# Altium schematic sheet LDO_DDS.SchDoc
size 420 x 297 mm; Address1: Address1; Address2: Address2; Address3: Address3; Address4: Address4; SheetNumber: 1; Scale: 1:1; Разраб.: Иванов; Обозначение документа: АБВГ.123456.001 Э3; Пров.: Петров; Утв.: Сидоров; Наименование организации: ОАО "Концерн "МПО-Гидроприбор"; Перв. применение: АБВГ.123456.000; Наименование изделия 1: Плата; Наименование изделия 2: Схема электрическая; Наименование изделия 3: принципиальная; Нач. отд.: Нач. отд.; Фамилия нач. отд.: Сидоров
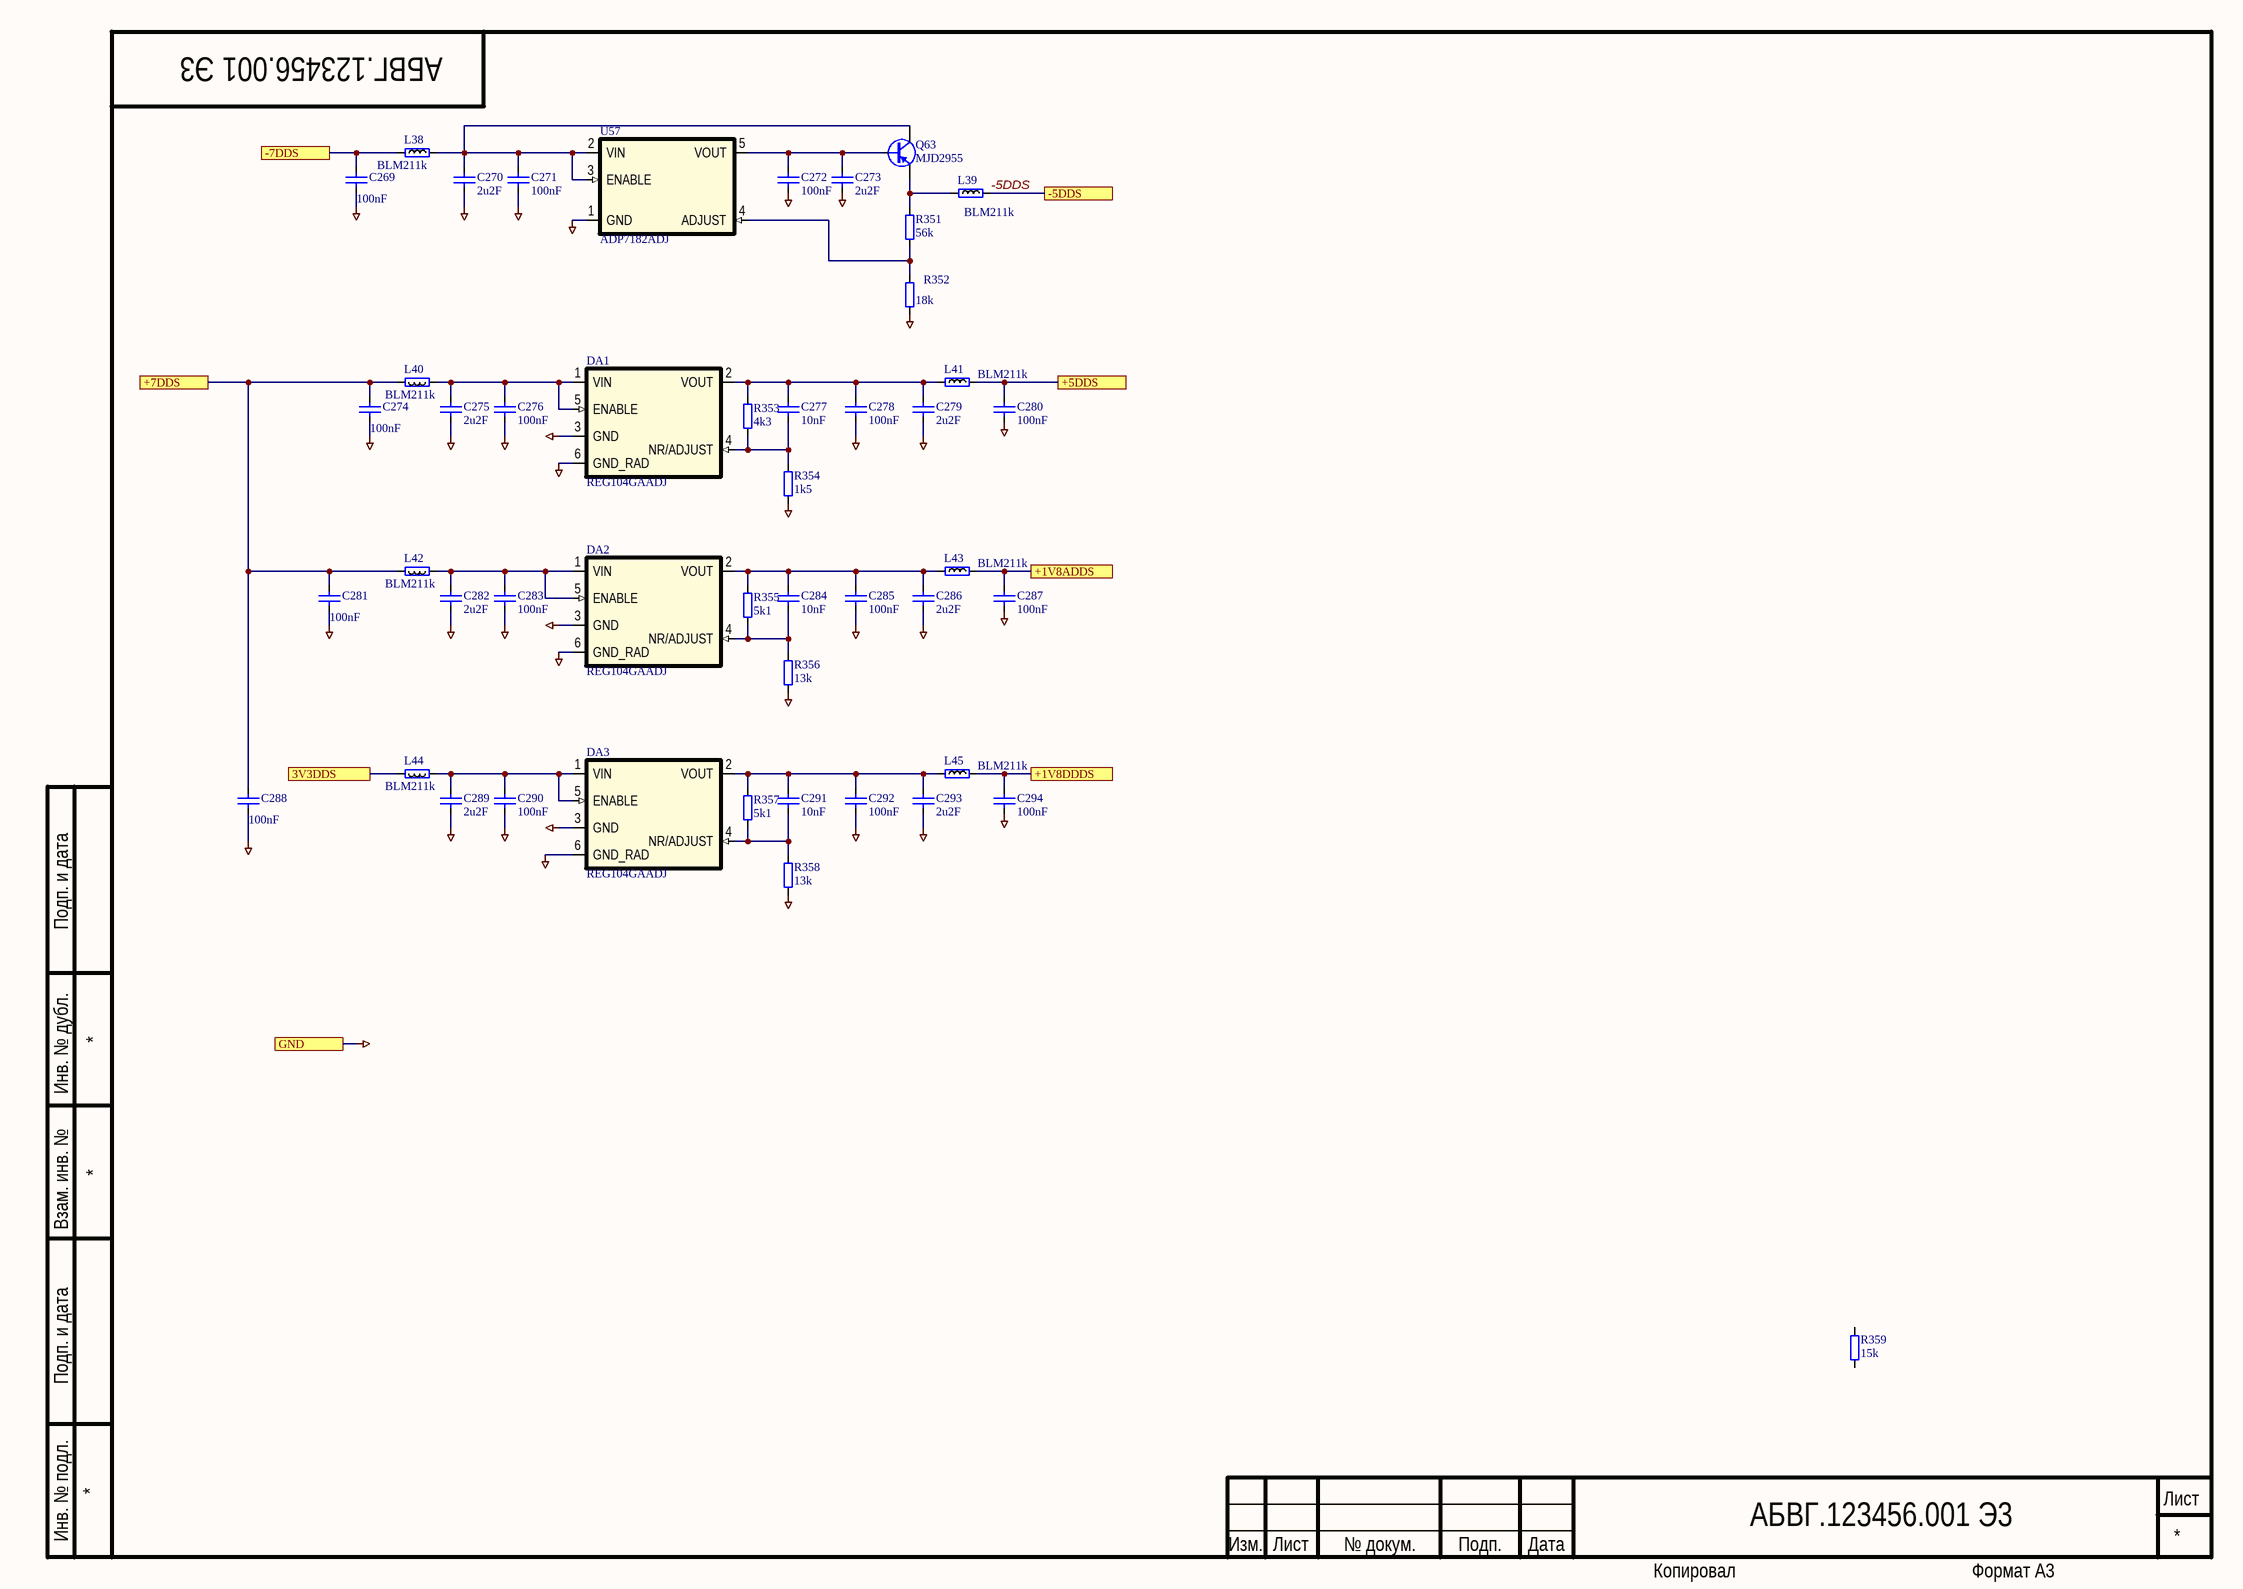
[diagram p0: LDO_DDS.SchDoc]

## Parts
C269  100nF  [SMD0805CAP]
C270  2u2F  [SMD0805CAP]
C271  100nF  [SMD0805CAP]
C272  100nF  [SMD0805CAP]
C273  2u2F  [SMD0805CAP]
C274  100nF  [SMD0805CAP]
C275  2u2F  [SMD0805CAP]
C276  100nF  [SMD0805CAP]
C277  10nF  [SMD0805CAP]
C278  100nF  [SMD0805CAP]
C279  2u2F  [SMD0805CAP]
C280  100nF  [SMD0805CAP]
C281  100nF  [SMD0805CAP]
C282  2u2F  [SMD0805CAP]
C283  100nF  [SMD0805CAP]
C284  10nF  [SMD0805CAP]
C285  100nF  [SMD0805CAP]
C286  2u2F  [SMD0805CAP]
C287  100nF  [SMD0805CAP]
C288  100nF  [SMD0805CAP]
C289  2u2F  [SMD0805CAP]
C290  100nF  [SMD0805CAP]
C291  10nF  [SMD0805CAP]
C292  100nF  [SMD0805CAP]
C293  2u2F  [SMD0805CAP]
C294  100nF  [SMD0805CAP]
DA1  REG104GAADJ  [SOT223_6-127]
DA2  REG104GAADJ  [SOT223_6-127]
DA3  REG104GAADJ  [SOT223_6-127]
L38  BLM211k  [RESC2012X50N]
L39  BLM211k  [RESC2012X50N]
L40  BLM211k  [RESC2012X50N]
L41  BLM211k  [RESC2012X50N]
L42  BLM211k  [RESC2012X50N]
L43  BLM211k  [RESC2012X50N]
L44  BLM211k  [RESC2012X50N]
L45  BLM211k  [RESC2012X50N]
Q63  MJD2955  [DPAK]
R351  56k  [SMD0805RES]
R352  18k  [SMD0805RES]
R353  4k3  [SMD0805RES]
R354  1k5  [SMD0805RES]
R355  5k1  [SMD0805RES]
R356  13k  [SMD0805RES]
R357  5k1  [SMD0805RES]
R358  13k  [SMD0805RES]
R359  15k  [SMD0805RES]
U57  ADP7182ADJ  [SOT23-5]

## Ports
3V3DDS, +1V8ADDS, +1V8DDDS, +5DDS, +7DDS, -5DDS, -7DDS, GND

## Nets
GND: C269.2 C270.2 C271.2 C272.1 C273.1 C274.2 C275.1 C276.1 C278.1 C279.1 C280.1 C281.2 C282.1 C283.1 C285.1 C286.1 C287.1 C288.2 C289.1 C290.1 C292.1 C293.1 C294.1 DA1.3(GND) DA1.6(GND_RAD) DA2.3(GND) DA2.6(GND_RAD) DA3.3(GND) DA3.6(GND_RAD) R352.1 R354.1 R356.1 R358.1 U57.1(GND) ; port GND
3V3DDS: L44.1 ; port 3V3DDS
+1V8ADDS: C287.2 L43.1 ; port +1V8ADDS
+1V8DDDS: C294.2 L45.1 ; port +1V8DDDS
+5DDS: C280.2 L41.1 ; port +5DDS
+7DDS: C274.1 C281.1 C288.1 L40.1 L42.1 ; port +7DDS
-5DDS: L39.1 ; port -5DDS
-7DDS: C269.1 L38.2 ; port -7DDS
NetC270_1: C270.1 C271.1 L38.1 Q63.3(C) U57.2(VIN) U57.3(ENABLE)
NetC272_2: C272.2 C273.2 Q63.1(B) U57.5(VOUT)
NetC275_2: C275.2 C276.2 DA1.1(VIN) DA1.5(ENABLE) L40.2
NetC277_1: C277.1 DA1.4(NR/ADJUST) R353.1 R354.2
NetC277_2: C277.2 C278.2 C279.2 DA1.2(VOUT) L41.2 R353.2
NetC282_2: C282.2 C283.2 DA2.1(VIN) DA2.5(ENABLE) L42.2
NetC284_1: C284.1 DA2.4(NR/ADJUST) R355.1 R356.2
NetC284_2: C284.2 C285.2 C286.2 DA2.2(VOUT) L43.2 R355.2
NetC289_2: C289.2 C290.2 DA3.1(VIN) DA3.5(ENABLE) L44.2
NetC291_1: C291.1 DA3.4(NR/ADJUST) R357.1 R358.2
NetC291_2: C291.2 C292.2 C293.2 DA3.2(VOUT) L45.2 R357.2
NetL39_2: L39.2 Q63.2(E) R351.2
NetR351_1: R351.1 R352.2 U57.4(ADJUST)

Not connected (* = marked no-connect by the designer): R359 1 2

## Notes on the sheet
- Подп. и дата
- Инв. № дубл.
- Взам. инв. №
- Инв. № подл.
- Изм.
- Лист
- № докум.
- Подп.
- Дата
- Копировал
- Формат А3

## Library data of the parts
C269-C294 = C0805: Чип конденсатор 0805; Voltage: 25V; Vendor: Vishay; DielectricType: X5R; SMD Solders: 2; Solder Option: RM; Tolerance: 20%; Pkg: SMD0805; Device: Cap0805; Price: 2
  C269 C271 C272 C274 C276 C278 C280 C281 C283 C285 C287 C288 C290 C292 C294: Value: 100nF
  C270 C273 C275 C279 C282 C286 C289 C293: Value: 2u2F
  C277 C284 C291: Value: 10nF
DA1-DA3 = REG104GA: Positive LDO Linear stabilizer; Vendor: Texas Instruments; Value: ADJ; SMD Solders: 6; Solder Option: RM; TC: 70ppm/C; Tolerance: +-2% Max; Pkg: SOT223-6; Name to order: REG104GA-A; Vref: 1V295; Price: 1000; Device: REG104GA
L38 L40 L42 L44 = BLM21: SMD Ferrite bead 0805; Vendor: Vishay; Value: 1k; Pkg: SMD0805; SMD Solders: 2; Solder Option: RM; Price: 10; Device: BLM21
L39 L41 L43 L45 = BLM21: SMD Ferrite bead 0805; Vendor: Vishay; Value: 1k; Pkg: SMD0805; SMD Solders: 2; Solder Option: DBG; Price: 10; Device: BLM21
Q63 = MJD2955: PNP транзистор; Vendor: ON Semiconductor; SMD Solders: 3; Solder Option: RM; Name to order: MJD29G55; Voltage: -60V; Pkg: DPAK; Price: 100; Device: MJD2955
R351 R353 R355 R357 R359 = R0805: Чип резистор 0805; Vendor: Vishay; SMD Solders: 2; Solder Option: RM; TC: 100ppm/C; Tolerance: 1%; Pkg: SMD0805; Pwr: 125mW; Device: Res0805; Price: 2
  R351: Value: 56k
  R353: Value: 4k3
  R355 R357: Value: 5k1
  R359: Value: 15k
R352 R354 R356 R358 = R0805: Чип резистор 0805; Vendor: Vishay; SMD Solders: 2; Solder Option: ADJ; TC: 100ppm/C; Tolerance: 1%; Pkg: SMD0805; Pwr: 125mW; Device: Res0805; Price: 2
  R352: Value: 18k
  R354: Value: 1k5
  R356 R358: Value: 13k
U57 = ADP7182: Negative LDO Linear stabilizer; Vendor: Analog Devoces; Value: ADJ; SMD Solders: 5; Solder Option: RM; Name to order: ADP7182AUJZ-R7; Vref: 1V22; Pkg: SOT23-5; Price: 100; Device: ADP7182